# Altium schematic sheet Microcontroller.SchDoc
size A4; SheetNumber: 1
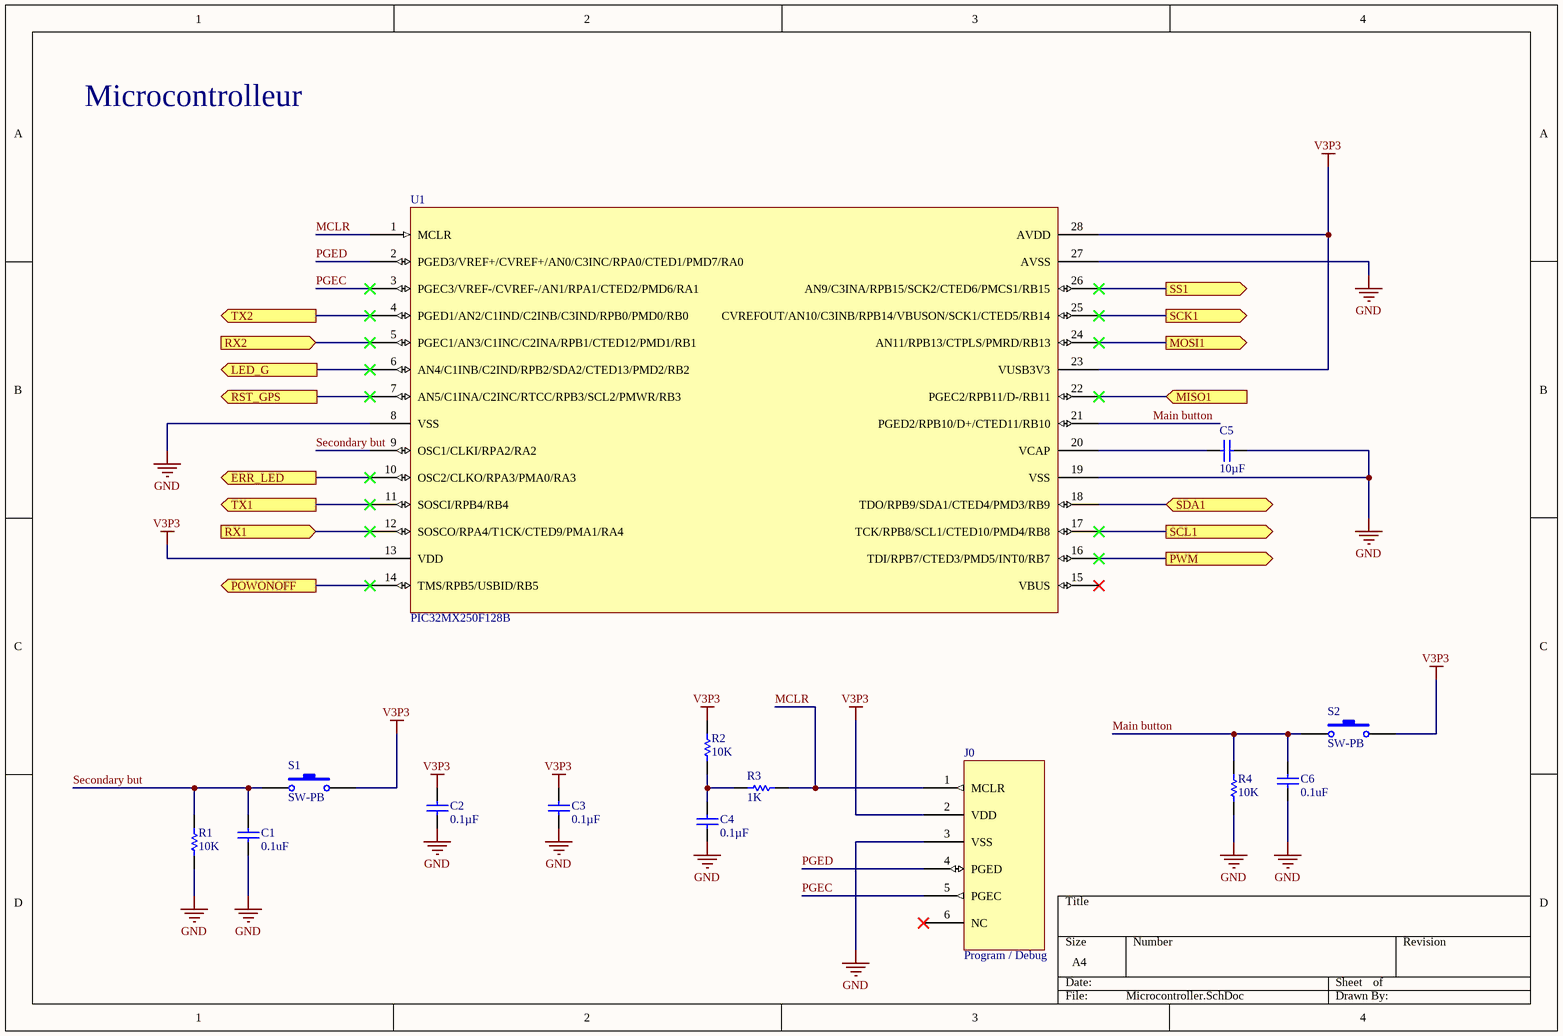
[diagram p0: Microcontroller.SchDoc]

## Parts
C1  0.1uF  [own_0603]
C2  0.1µF  [own_0603]
C3  0.1µF  [own_0603]
C4  0.1µF  [own_0603]
C5  10µF  [own_0603]
C6  0.1uF  [own_0603]
J0  Program / Debug  [C-Grid III X6]
R1  10K  [own_0603]
R2  10K  [own_0603]
R3  1K  [own_0603]
R4  10K  [own_0603]
S1  SW-PB  [SWTCH 1]
S2  SW-PB  [SWTCH 1]
U1  PIC32MX250F128B  [PIC32MX250F128/SO]

## Ports
ERR_LED (out), LED_G (out), MISO1 (in), MOSI1 (out), POWONOFF (out), PWM (out), RST_GPS (out), RX1 (in), RX2 (in), SCK1 (out), SCL1 (out), SDA1 (bidir), SS1 (out), TX1 (out), TX2 (out)

## Nets
GND: C1.1 C2.1 C3.1 C4.1 C5.1 C6.1 J0.3(VSS) R1.1 R4.1 U1.8(VSS) U1.19(VSS) U1.27(AVSS)
V3P3: C2.2 C3.2 J0.2(VDD) R2.2 S1.2 S2.2 U1.13(VDD) U1.23(VUSB3V3) U1.28(AVDD)
ERR_LED: U1.10(OSC2/CLKO/RPA3/PMA0/RA3) ; port ERR_LED
LED_G: U1.6(AN4/C1INB/C2IND/RPB2/SDA2/CTED13/PMD2/RB2) ; port LED_G
Main button: C6.2 R4.2 S2.1 U1.21(PGED2/RPB10/D+/CTED11/RB10)
MCLR: J0.1(MCLR) R3.2 U1.1(MCLR)
MISO1: U1.22(PGEC2/RPB11/D-/RB11) ; port MISO1
MOSI1: U1.24(AN11/RPB13/CTPLS/PMRD/RB13) ; port MOSI1
PGEC: J0.5(PGEC) U1.3(PGEC3/VREF-/CVREF-/AN1/RPA1/CTED2/PMD6/RA1)
PGED: J0.4(PGED) U1.2(PGED3/VREF+/CVREF+/AN0/C3INC/RPA0/CTED1/PMD7/RA0)
POWONOFF: U1.14(TMS/RPB5/USBID/RB5) ; port POWONOFF
PWM: U1.16(TDI/RPB7/CTED3/PMD5/INT0/RB7) ; port PWM
RST_GPS: U1.7(AN5/C1INA/C2INC/RTCC/RPB3/SCL2/PMWR/RB3) ; port RST_GPS
RX1: U1.12(SOSCO/RPA4/T1CK/CTED9/PMA1/RA4) ; port RX1
RX2: U1.5(PGEC1/AN3/C1INC/C2INA/RPB1/CTED12/PMD1/RB1) ; port RX2
SCK1: U1.25(CVREFOUT/AN10/C3INB/RPB14/VBUSON/SCK1/CTED5/RB14) ; port SCK1
SCL1: U1.17(TCK/RPB8/SCL1/CTED10/PMD4/RB8) ; port SCL1
SDA1: U1.18(TDO/RPB9/SDA1/CTED4/PMD3/RB9) ; port SDA1
Secondary but: C1.2 R1.2 S1.1 U1.9(OSC1/CLKI/RPA2/RA2)
SS1: U1.26(AN9/C3INA/RPB15/SCK2/CTED6/PMCS1/RB15) ; port SS1
TX1: U1.11(SOSCI/RPB4/RB4) ; port TX1
TX2: U1.4(PGED1/AN2/C1IND/C2INB/C3IND/RPB0/PMD0/RB0) ; port TX2
NetC4_2: C4.2 R2.1 R3.1
NetC5_2: C5.2 U1.20(VCAP)

Not connected (* = marked no-connect by the designer): J0 6(NC)*; U1 15(VBUS)*

## Notes on the sheet
- Microcontrolleur

## Library data of the parts
C1 = Cap: Capacitor; Value: 10uF; RefFabricant: 0603YC104KAZ2A; Fournisseur: Farnell; Fabricant: AVX
C2 C3 = Cap: Capacitor; RefFabricant: 0603YC104KAZ2A; Fournisseur: Farnell; Fabricant: AVX; RefFournisseur: 7569556; Value: 0.1µF
C4 = Cap: Capacitor; RefFabricant: 0603YC104KAZ2A; Fabricant: AVX; Fournisseur: Farnell; RefFournisseur: 7569556; Value: 0.1µF
C5 = Cap: Capacitor; Fournisseur: Farnell; Fabricant: MURATA; RefFabricant: GRM188R60J106KE47D; RefFournisseur: 2494230; Value: 10µF
C6 = Cap: Capacitor; Value: 10uF; RefFabricant: 0603YC104KAZ2A; Fournisseur: Farnell; Fabricant: AVX; RefFournisseur: 7569556
J0 = ICSP: Fabricant: Molex; Fournisseur: Farnell; RefFournisseur: 9731172; RefFabricant: 22-27-2061
R1 R2 R4 = Res1: Resistor; Fournisseur: Farnell; Fabricant: PANASONIC ELECTRONIC COMPONENTS; RefFabricant: ERA3ARW103V; RefFournisseur: 1688472
R3 = Res1: Resistor; Fabricant: PANASONIC ELECTRONIC COMPONENTS; Fournisseur: Farnell; RefFabricant: ERA3ARB102V; RefFournisseur: 1717570; Value: 1K
S1 S2 = SW-PB: Switch; Fabricant: ALCOSWITCH - TE CONNECTIVITY; Fournisseur: Farnell; RefFabricant: 1437566-3; RefFournisseur: 2468741
U1 = PIC32MX250F128B: Microcontrolleur; Fabricant: Microchip; RefFabricant: PIC32MX250F128B-I/SO; Fournisseur: Farnell; RefFournisseur: 2097772